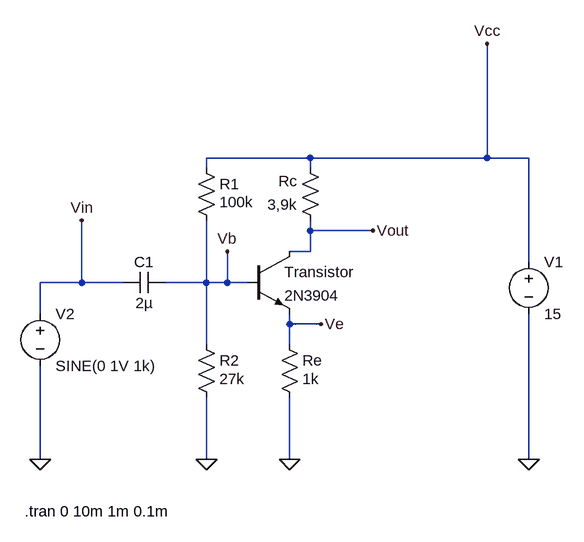
[diagram p0: schematic Task 1.asc]
Task 1.asc, the LTspice schematic file:
Version 4
SHEET 1 880 680
WIRE 128 -16 -32 -16
WIRE 400 -16 400 -192
WIRE 400 -16 128 -16
WIRE 464 -16 400 -16
WIRE -32 0 -32 -16
WIRE 128 0 128 -16
WIRE 128 96 128 80
WIRE 224 96 128 96
WIRE 128 128 128 96
WIRE 128 128 96 128
WIRE 464 144 464 -16
WIRE -224 176 -224 80
WIRE -224 176 -288 176
WIRE -160 176 -224 176
WIRE -32 176 -32 80
WIRE -32 176 -96 176
WIRE 0 176 0 128
WIRE 0 176 -32 176
WIRE 32 176 0 176
WIRE -288 224 -288 176
WIRE 96 240 96 224
WIRE 144 240 96 240
WIRE -32 272 -32 176
WIRE 96 272 96 240
WIRE -288 448 -288 304
WIRE -32 448 -32 352
WIRE 96 448 96 352
WIRE 464 448 464 224
FLAG 464 448 0
FLAG 96 448 0
FLAG -32 448 0
FLAG -288 448 0
FLAG 400 -192 Vcc
FLAG -224 80 Vin
FLAG 0 128 Vb
FLAG 224 96 Vout
FLAG 144 240 Ve
SYMBOL voltage 464 128 R0
WINDOW 123 0 0 Left 0
WINDOW 39 0 0 Left 0
SYMATTR InstName V1
SYMATTR Value 15
SYMBOL npn 32 128 R0
SYMATTR InstName Transistor
SYMATTR Value 2N3904
SYMBOL cap -96 160 R90
WINDOW 0 0 32 VBottom 2
WINDOW 3 32 32 VTop 2
SYMATTR InstName C1
SYMATTR Value 2µ
SYMBOL res -48 -16 R0
WINDOW 3 36 68 Left 2
SYMATTR Value 100k
SYMATTR InstName R1
SYMBOL res 80 256 R0
WINDOW 3 36 68 Left 2
SYMATTR Value 1k
SYMATTR InstName Re
SYMBOL res -48 256 R0
WINDOW 3 36 68 Left 2
SYMATTR Value 27k
SYMATTR InstName R2
SYMBOL voltage -288 208 R0
WINDOW 123 0 0 Left 0
WINDOW 39 0 0 Left 0
SYMATTR InstName V2
SYMATTR Value SINE(0 1V 1k)
SYMBOL res 144 96 R180
WINDOW 0 36 76 Left 2
WINDOW 3 36 40 Left 2
SYMATTR InstName Rc
SYMATTR Value 3,9k
TEXT -312 528 Left 2 !.tran 0 10m 1m 0.1m

The netlist it stands for:
* Task 1.asc
V1 Vcc 0 15
Q§Transistor Vout Vb Ve 0 2N3904
C1 Vb Vin 2µ
R1 Vcc Vb 100k
Re Ve 0 1k
R2 Vb 0 27k
V2 Vin 0 SINE(0 1V 1k)
Rc Vout Vcc 3,9k
.model NPN NPN
.model PNP PNP
.lib standard.bjt
.tran 0 10m 1m 0.1m
.backanno
.end